# EAGLE design Meldetableau16 (EAGLE 5.04)
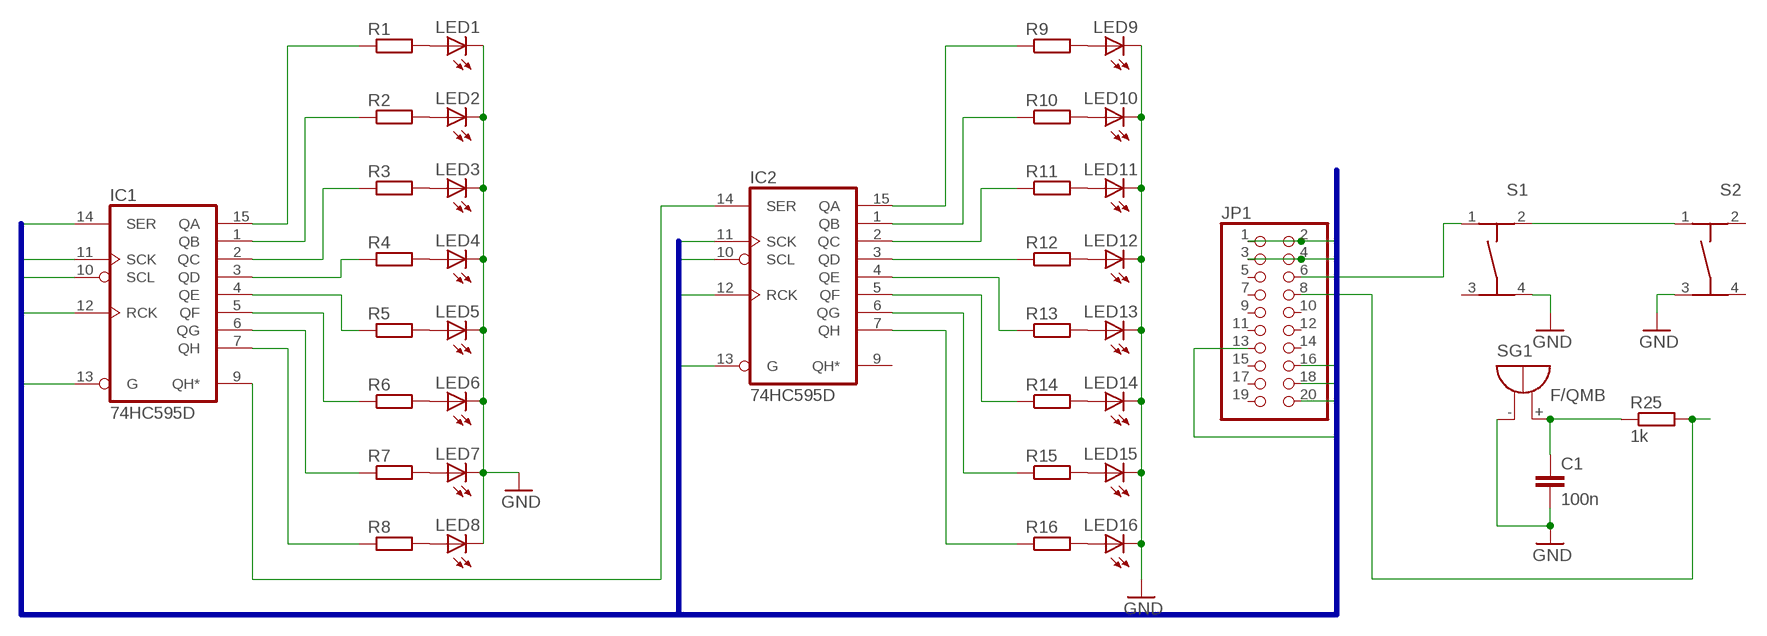
[diagram p0: schematic, sheet 1]

## Parts
C1  100n  C-EUC1206  [C1206]
IC1  74HC595D  [SO16]
IC2  74HC595D  [SO16]
JP1  PINHD-2X10_2.54-SMD  [2X10SMD]
LED1  LEDCHIPLED_1206  [CHIPLED_1206]
LED2  LEDCHIPLED_1206  [CHIPLED_1206]
LED3  LEDCHIPLED_1206  [CHIPLED_1206]
LED4  LEDCHIPLED_1206  [CHIPLED_1206]
LED5  LEDCHIPLED_1206  [CHIPLED_1206]
LED6  LEDCHIPLED_1206  [CHIPLED_1206]
LED7  LEDCHIPLED_1206  [CHIPLED_1206]
LED8  LEDCHIPLED_1206  [CHIPLED_1206]
LED9  LEDCHIPLED_1206  [CHIPLED_1206]
LED10  LEDCHIPLED_1206  [CHIPLED_1206]
LED11  LEDCHIPLED_1206  [CHIPLED_1206]
LED12  LEDCHIPLED_1206  [CHIPLED_1206]
LED13  LEDCHIPLED_1206  [CHIPLED_1206]
LED14  LEDCHIPLED_1206  [CHIPLED_1206]
LED15  LEDCHIPLED_1206  [CHIPLED_1206]
LED16  LEDCHIPLED_1206  [CHIPLED_1206]
R1  R-EU_R1206  [R1206]
R2  R-EU_R1206  [R1206]
R3  R-EU_R1206  [R1206]
R4  R-EU_R1206  [R1206]
R5  R-EU_R1206  [R1206]
R6  R-EU_R1206  [R1206]
R7  R-EU_R1206  [R1206]
R8  R-EU_R1206  [R1206]
R9  R-EU_R1206  [R1206]
R10  R-EU_R1206  [R1206]
R11  R-EU_R1206  [R1206]
R12  R-EU_R1206  [R1206]
R13  R-EU_R1206  [R1206]
R14  R-EU_R1206  [R1206]
R15  R-EU_R1206  [R1206]
R16  R-EU_R1206  [R1206]
R25  1k  R-EU_R1206  [R1206]
S1  TASTER-9314_SMD  [TASTER-9314_SMD]
S2  TASTER-9314_SMD  [TASTER-9314_SMD]
SG1  F/QMB  [F/QMB]

## Nets
G: IC1.13(G) IC2.13(G) JP1.13
GND: C1.2 JP1.1 JP1.2 LED1.C LED2.C LED3.C LED4.C LED5.C LED6.C LED7.C LED8.C LED9.C LED10.C LED11.C LED12.C LED13.C LED14.C LED15.C LED16.C S1.4 S2.3 SG1.-(+)
N$1: LED1.A R1.2
N$2: LED2.A R2.2
N$3: LED3.A R3.2
N$4: LED4.A R4.2
N$5: LED5.A R5.2
N$6: LED6.A R6.2
N$7: LED7.A R7.2
N$8: LED8.A R8.2
N$9: LED9.A R9.2
N$10: LED10.A R10.2
N$11: LED11.A R11.2
N$12: LED12.A R12.2
N$13: LED13.A R13.2
N$14: LED14.A R14.2
N$15: LED15.A R15.2
N$16: LED16.A R16.2
N$17: JP1.8 R25.2
N$18: C1.1 R25.1 SG1.+(-)
N$19: IC1.15(QA) R1.1
N$20: IC1.1(QB) R2.1
N$21: IC1.2(QC) R3.1
N$22: IC1.3(QD) R4.1
N$23: IC1.4(QE) R5.1
N$24: IC1.5(QF) R6.1
N$25: IC1.6(QG) R7.1
N$26: IC1.7(QH) R8.1
N$27: IC1.9(QH*) IC2.14(SER)
N$28: IC2.15(QA) R9.1
N$29: IC2.1(QB) R10.1
N$30: IC2.2(QC) R11.1
N$31: IC2.3(QD) R12.1
N$32: IC2.4(QE) R13.1
N$33: IC2.5(QF) R14.1
N$34: IC2.6(QG) R15.1
N$35: IC2.7(QH) R16.1
N$36: JP1.6 S1.1
N$38: S1.2 S2.1
RCK: IC1.12(RCK) IC2.12(RCK) JP1.16
SCK: IC1.11(SCK) IC2.11(SCK) JP1.18
SER: IC1.14(SER) JP1.20
VCC: IC1.10(SCL) IC2.10(SCL) JP1.3 JP1.4
Unconnected: IC2.9(QH*) JP1.5 JP1.7 JP1.9 JP1.10 JP1.11 JP1.12 JP1.14 JP1.15 JP1.17 JP1.19 S1.3 S2.2 S2.4

## Buses
VCC,GND,SER,SCK,RCK,G

## Power pins joined to a net without a drawn wire
GND: IC1.8(GND) IC2.8(GND)
VCC: IC1.16(VCC) IC2.16(VCC)

## Library data of the parts
C1 = rcl:C-EU: CAPACITOR, European symbol
IC1 IC2 = 74xx-eu:74*595: 8-bit SHIFT REGISTER, output latch
JP1 = pinhead:PINHD-2X10: PIN HEADER
LED1-LED16 = led:LED: LED OSRAM: - CHIPLED LG R971, LG N971, LY N971, LG Q971, LY Q971, LO R971, LY R971 LH N974, LH R974 LS Q976, LO Q976, LY Q976 LO Q996 - Hyper CHIPLED LW Q18S LB Q993, LB Q99A, LB R99A - SideLED LS A670, LO A670, LY A670, LG A670, LP A670 LB A673, LV A673, LT A673, LW A673 LH A674 LY A675 LS A676, LA A676, LO A676, LY A676, LW A676 LS A679, LY A679, LG A679 - Hyper Micro SIDELED® LS Y876, LA Y876, LO Y876, LY Y876 LT Y87S - SmartLED LW L88C, LW L88S LB L89C, LB L89S, LG L890 LS L89K, LO L89K, LY L89K LS L896, LA L896, LO L896, LY L896 - TOPLED LS T670, LO T670, LY T670, LG T670, LP T670 LSG T670, LSP T670, LSY T670, LOP T670, LYG T670 LG T671, LOG T671, LSG T671 LB T673, LV T673, LT T673, LW T673 LH T674 LS T676, LA T676, LO T676, LY T676, LB T676, LH T676, LSB T676, LW T676 LB T67C, LV T67C, LT T67C, LS T67K, LO T67K, LY T67K, LW E67C LS E67B, LA E67B, LO E67B, LY E67B, LB E67C, LV E67C, LT E67C LW T67C LS T679, LY T679, LG T679 LS T770, LO T770, LY T770, LG T770, LP T770 LB T773, LV T773, LT T773, LW T773 LH T774 LS E675, LA E675, LY E675, LS T675 LS T776, LA T776, LO T776, LY T776, LB T776 LHGB T686 LT T68C, LB T68C - Hyper Mini TOPLED® LB M676 - Mini TOPLED Santana® LG M470 LS M47K, LO M47K, LY M47K Source: http://www.osram.convergy.de - LUMILED® LXK2-PW12-R00, LXK2-PW12-S00, LXK2-PW14-U00, LXK2-PW14-V00 LXK2-PM12-R00, LXK2-PM12-S00, LXK2-PM14-U00 LXK2-PE12-Q00, LXK2-PE12-R00, LXK2-PE12-S00, LXK2-PE14-T00, LXK2-PE14-U00 LXK2-PB12-K00, LXK2-PB12-L00, LXK2-PB12-M00, LXK2-PB14-N00, LXK2-PB14-P00, LXK2-PB14-Q00 LXK2-PR12-L00, LXK2-PR12-M00, LXK2-PR14-Q00, LXK2-PR14-R00 LXK2-PD12-Q00, LXK2-PD12-R00, LXK2-PD12-S00 LXK2-PH12-R00, LXK2-PH12-S00 LXK2-PL12-P00, LXK2-PL12-Q00, LXK2-PL12-R00 Source: www.luxeon.com
R1-R16 R25 = rcl:R-EU_: RESISTOR, European symbol
S1 S2 = Ergaenzung:TASTER-9314_SMD
SG1 = buzzer:F/QMB: BUZZER Source: Buerklin

## Board
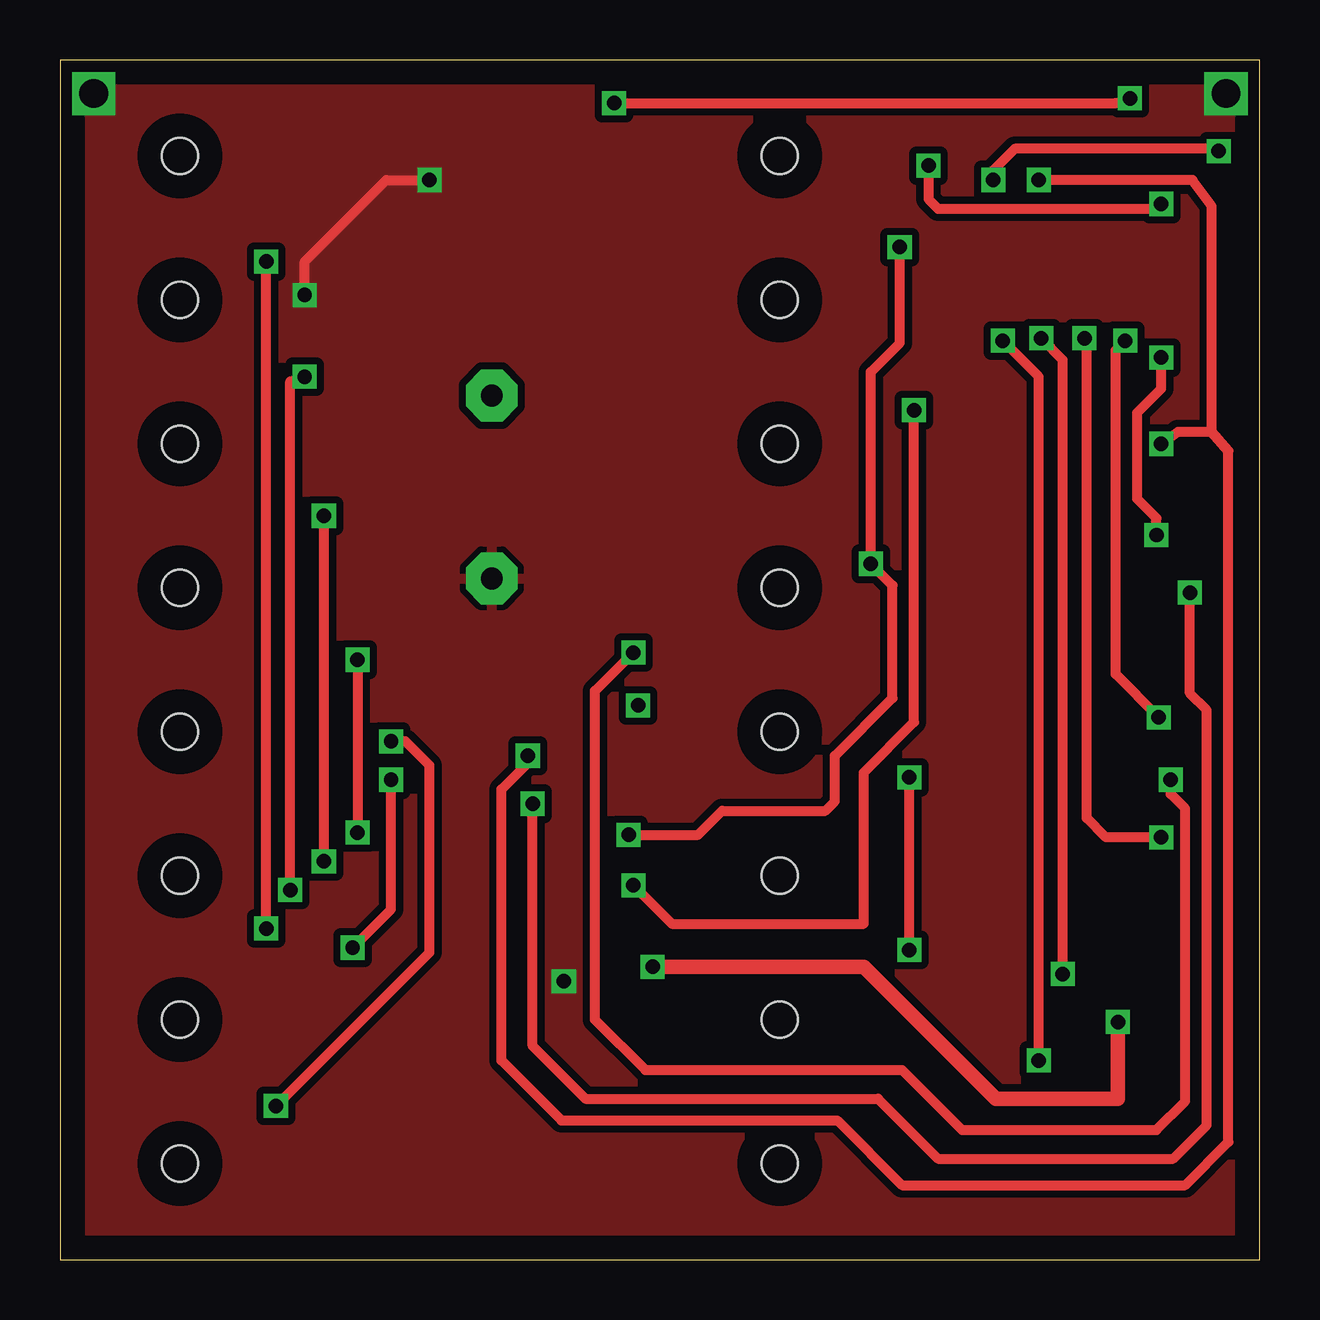
[diagram p1: board, top side]
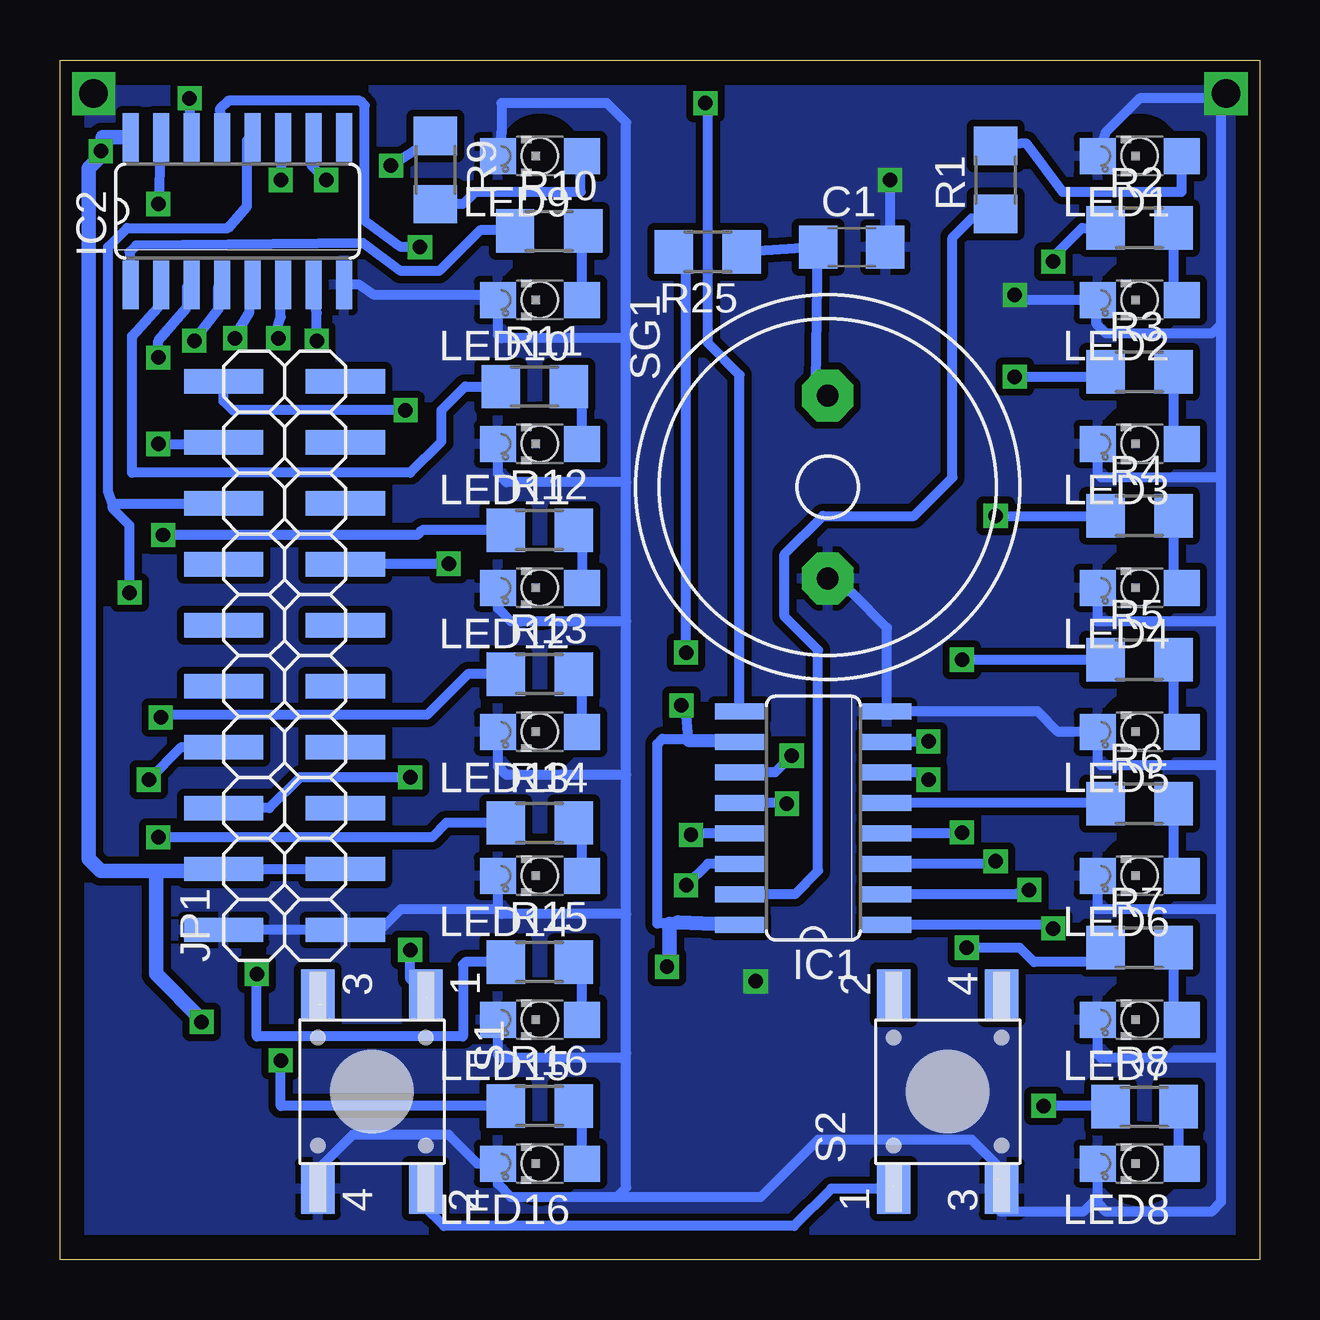
[diagram p2: board, bottom side, seen from below]

Size 50 x 50 mm. Coordinates in mm from the lower left corner, seen from the top.
Outline: 0,0 50,0 50,50 0,50 0,0
Copper layers (1*16): Top 0.035mm / dielectric 1.5mm / Bottom 0.035mm
Design rules "default": minimum track width 10mil, minimum drill 24mil, track to track 8mil, track to pad 8mil, pad to pad 8mil, via to via 8mil, smd to smd 8mil, copper to edge 40mil, drill to drill 8mil, minimum pad ring 10mil, minimum via ring 8mil, stop-mask expansion 4mil, vias tented up to drill 0mil, thermal gap 10mil
Holes 1.5 mm at 5,46 5,40 5,34 5,28 5,22 5,16 5,10 5,4 30,46 30,40 30,34 30,28 30,22 30,16 30,10 30,4

### Footprints (pad centres in the part's own frame; a part is rotated, then mirrored left to right if it is on the bottom)
C1206 = smd 1.6 x 1.8: 1 -1.4,0; 2 1.4,0
SO16 = smd 0.66 x 2.032: 1 -4.445,-3.073; 2 -3.175,-3.073; 3 -1.905,-3.073; 4 -0.635,-3.073; 5 0.635,-3.073; 6 1.905,-3.073; 7 3.175,-3.073; 8 4.445,-3.073; 9 4.445,3.073; 10 3.175,3.073; 11 1.905,3.073; 12 0.635,3.073; 13 -0.635,3.073; 14 -1.905,3.073; 15 -3.175,3.073; 16 -4.445,3.073
2X10SMD = smd 1.016 x 3.302: 1 -1.27,-3.81; 2 -1.27,1.27; 3 1.27,-3.81; 4 1.27,1.27; 5 3.81,-3.81; 6 3.81,1.27; 7 6.35,-3.81; 8 6.35,1.27; 9 8.89,-3.81; 10 8.89,1.27; 11 11.43,-3.81; 12 11.43,1.27; 13 13.97,-3.81; 14 13.97,1.27; 15 16.51,-3.81; 16 16.51,1.27; 17 19.05,-3.81; 18 19.05,1.27; 19 21.59,-3.81; 20 21.59,1.27
CHIPLED_1206 = smd 1.5 x 1.5: A 0,-1.75; C 0,1.75
R1206 = smd 1.6 x 1.803: 1 -1.422,0; 2 1.422,0
TASTER-9314_SMD = smd 2.1 x 1.4: 1 -4.048,2.25; 2 4.048,2.25; 3 -4.048,-2.25; 4 4.048,-2.25
F/QMB = drill 0.914 pad 2.159 octagon: + 3.81,0; - -3.81,0

### Placement (x,y rotation side)
C1  17,42.2 0 bottom
IC1  18.6,18.4 90 bottom
IC2  42.6,43.7 0 bottom
JP1  41.91,15.01 90 bottom
LED1  5,46 90 bottom
LED2  5,40 90 bottom
LED3  5,34 90 bottom
LED4  5,28 90 bottom
LED5  5,22 90 bottom
LED6  5,16 90 bottom
LED7  5,10 90 bottom
LED8  5,4 90 bottom
LED9  30,46 90 bottom
LED10  30,40 90 bottom
LED11  30,34 90 bottom
LED12  30,28 90 bottom
LED13  30,22 90 bottom
LED14  30,16 90 bottom
LED15  30,10 90 bottom
LED16  30,4 90 bottom
R1  11,45 90 bottom
R2  5,43 0 bottom
R3  5,37 0 bottom
R4  5,31 0 bottom
R5  5,25 0 bottom
R6  5,19 0 bottom
R7  5,13 0 bottom
R8  4.79,6.37 0 bottom
R9  34.35,45.41 270 bottom
R10  29.61,42.87 0 bottom
R11  30.21,36.39 0 bottom
R12  30,30.4 0 bottom
R13  30,24.4 0 bottom
R14  30,18.2 0 bottom
R15  30,12.4 0 bottom
R16  30,6.4 0 bottom
R25  23,42 180 bottom
S1  37,7 270 bottom
S2  13,7 90 bottom
SG1  18,32.2 90 bottom

### Tracks (layer width: path | path; a pad name or v marks a point on that pad's centre or on a via)
G  (via drill 0.6)
  Top 0.406: v23.7,17.7 26.6,17.7 27.6,18.7 31.9,18.7 32.3,19.1 32.3,21 34.7,23.4 34.7,28.1 v33.8,29 33.8,37 35,38.2 v35,42.2
  Bottom 0.406: IC1.13 23.64,17.77 v23.7,17.7 | v33.8,29 38.08,29 JP1.13 | IC2.13 43.34,47.97 43,48.3 37.5,48.3 37.3,48.1 37.3,43.3 35.8,42.2 v35,42.2
GND  (via drill 0.6, 1.2)
  Top 0.406: v10.2,40.2 10.2,41.6 13.6,45 v15.4,45
  Bottom 0.406: LED1.C 6.4,47 5,48.4 2,48.4 1.6,48 1.6,39 | 1.6,39 2,38.6 6.4,38.6 6.8,39 6.8,39.75 LED2.C 10,40 v10.2,40.2 | LED3.C 6.75,32.75 6.6,32.6 1.6,32.6 | 6.75,2.6 6.75,2.35 6.4,2 2,2 1.6,2.4 1.6,8.4 | 6.75,2.6 LED8.C | 1.6,8.4 1.6,14.6 | 1.6,14.6 1.6,20.6 | 1.6,20.6 1.6,26.8 | 1.6,26.8 1.6,32.6 | 1.6,32.6 1.6,39 | LED4.C 6.75,26.65 6.8,26.6 1.8,26.6 1.6,26.8 | 1.6,20.6 6.6,20.6 6.75,20.75 LED5.C 8.4,22 9.24,22.84 IC1.8 15.53,26.33 17,27.8 17.61,28 SG1.- | LED6.C 6.75,14.65 6.8,14.6 1.6,14.6 | LED7.C 6.75,8.55 6.6,8.4 1.6,8.4 | 6.75,2.6 7.35,2 10.8,2 10.75,2.05 S2.3 10.8,3 10.8,3.8 12,5 18.4,5 20.8,2.6 26.8,2.6 | S1.4 39.2,3 39.2,3.8 37.8,5.2 33.8,5.2 32.6,4 LED16.C 31.75,3.15 31.2,2.6 26.8,2.6 | LED9.C 31.6,47 31.6,48.2 27.2,48.2 26.4,47.4 26.4,38.4 | 26.4,8.6 26.4,3 26.8,2.6 | 26.4,8.6 26.4,14.4 | 26.4,14.4 26.4,20.2 | 26.4,20.2 26.4,26.6 | 26.4,26.6 26.4,32.4 | 26.4,32.4 26.4,38.4 | LED15.C 31.75,8.55 31.6,8.4 26.6,8.4 26.4,8.6 | 31.75,14.55 LED14.C | 31.75,14.55 31.6,14.4 26.4,14.4 | LED13.C 31.75,20.55 31.4,20.2 26.4,20.2 | LED12.C 31.75,27.15 31.2,26.6 26.4,26.6 | LED11.C 31.75,32.75 31.4,32.4 26.4,32.4 | 26.4,38.4 31.6,38.4 31.75,38.55 LED10.C 31.95,40.2 36.9,40.2 37.53,40.63 IC2.8 | v15.4,45 15.4,42.4 C1.2 | JP1.2 JP1.1 36.66,13.74 35.8,14.6 31.8,14.6 31.75,14.55
  other vias: 1.4,48.6 48.6,48.6 21,11.6
  pour Bottom (isolate 0.305): 0.1,0 0.1,50 50.1,50 50.1,0.1 0.4,0.1
  pour Top (isolate 0.305): 0.1,0.1 0.1,50 50,50 50,-0.1 0.7,-0.1
N$1
  Bottom 0.406: R1.2 9.72,46.52 8.2,44.5 3.25,44.5 LED1.A
N$2
  Bottom 0.406: R2.2 3.58,40.33 LED2.A
N$3
  Bottom 0.406: R3.2 3.58,34.33 LED3.A
N$4
  Bottom 0.406: R4.2 3.58,28.33 LED4.A
N$5
  Bottom 0.406: R5.2 3.58,22.33 LED5.A
N$6
  Bottom 0.406: R6.2 3.58,16.33 LED6.A
N$7
  Bottom 0.406: R7.2 3.58,10.33 LED7.A
N$8
  Bottom 0.406: R8.2 3.37,4.12 LED8.A
N$9
  Bottom 0.406: LED9.A 28.3,46 28.3,44.5 32.7,44.5 33.2,44 34.34,44 R9.2
N$10
  Bottom 0.406: LED10.A 28.25,42.25 28.4,42.4 28.4,42.66 R10.2
N$11
  Bottom 0.406: LED11.A 28.25,36.85 R11.2
N$12
  Bottom 0.406: LED12.A 28.25,30.67 R12.2
N$13
  Bottom 0.406: LED13.A 28.25,24.67 R13.2
N$14
  Bottom 0.406: LED14.A 28.25,18.67 R14.2
N$15
  Bottom 0.406: LED15.A 28.25,12.67 R15.2
N$16
  Bottom 0.406: LED16.A 28.25,6.67 R16.2
N$17  (via drill 0.6)
  Top 0.406: v46.3,20 46.3,19.4 46.9,18.8 46.9,6.6 45.7,5.4 37.6,5.4 35.1,7.9 24.4,7.9 22.3,10 22.3,23.7 v23.9,25.3
  Bottom 0.406: JP1.8 44.94,21.36 v46.3,20 | v23.9,25.3 23.9,41.48 R25.2
N$18
  Bottom 0.406: SG1.+ 18.5,36.51 C1.1 R25.1
N$19
  Bottom 0.406: IC1.15 19.38,15.22 18.4,16.2 18.4,25.4 19.8,26.8 19.8,29.4 18.2,31 14.4,31 12.8,32.6 12.8,42.6 12,43.4 10.58,43.4 R1.1
N$20  (via drill 0.6)
  Top 0.406: v8.6,13.8 v8.6,41.6
  Bottom 0.406: IC1.1 8.96,13.96 v8.6,13.8 | v8.6,41.6 8.6,41.8 7.4,43 R2.1
N$21  (via drill 0.6)
  Top 0.406: v9.6,15.4 9.6,36.6 v10.2,36.8
  Bottom 0.406: IC1.2 10.18,15.22 v9.6,15.4 | v10.2,36.8 6.62,36.8 R3.1
N$22  (via drill 0.6)
  Top 0.406: v11,16.6 v11,31
  Bottom 0.406: IC1.3 11.3,16.5 v11,16.6 | v11,31 R4.1
N$23  (via drill 0.6)
  Top 0.406: v12.4,25 v12.4,17.8
  Bottom 0.406: IC1.4 12.84,17.77 v12.4,17.8 | R5.1 v12.4,25
N$24
  Bottom 0.406: IC1.5 6.46,19.04 R6.1
N$25  (via drill 0.6)
  Top 0.406: v13.8,20 13.8,14.6 v12.2,13
  Bottom 0.406: IC1.6 14.11,20.3 v13.8,20 | v12.2,13 10,13 9.4,12.4 7.02,12.4 R7.1
N$26  (via drill 0.6)
  Top 0.406: v13.8,21.6 14.4,21.6 15.4,20.6 15.4,12.8 v9,6.4
  Bottom 0.406: IC1.7 14.03,21.57 v13.8,21.6 | v9,6.4 6.24,6.4 R8.1
N$27  (via drill 0.6)
  Top 0.406: v23.1,48.2 44,48.2 v44.6,48.4
  Bottom 0.406: IC1.9 21.67,36.87 23,38.2 23,48.1 v23.1,48.2 | 44.6,48 44.6,46.78 IC2.14 | 44.6,48 44.6,48.3 | v44.6,48.4 44.6,48
N$28  (via drill 0.6)
  Top 0.406: v45.9,44 45.4,43.8 36.6,43.8 36.2,44.2 v36.2,45.6
  Bottom 0.406: IC2.15 45.88,44.12 v45.9,44 | v36.2,45.6 34.48,46.7 R9.1
N$29
  Bottom 0.406: IC2.1 47.1,40.67 47.1,42 46.83,42.27 37.37,42.37 35.8,41.2 34.2,41.2 32.5,42.9 31.06,42.9 R10.1
N$30
  Bottom 0.406: R11.1 33.11,36.39 34.1,35.4 34.1,34.1 35.4,32.8 47,32.8 47,38.5 45.9,39.7 45.9,40.6 IC2.2
N$31  (via drill 0.6)
  Top 0.406: v45.7,30.2 45.7,30.9 44.9,31.7 44.9,35.3 45.9,36.3 v45.9,37.6
  Bottom 0.406: R12.1 34.9,30.4 35.1,30.2 v45.7,30.2 | v45.9,37.6 45.9,38.3 44.7,39.7 44.7,40.53 IC2.3
N$32  (via drill 0.6)
  Top 0.406: v45.8,22.6 44,24.4 44,37.9 v44.4,38.3
  Bottom 0.406: R13.1 33,24.4 34.7,22.7 45.7,22.7 v45.8,22.6 | v44.4,38.3 43.4,39.6 43.4,40.56 IC2.4
N$33  (via drill 0.6)
  Top 0.406: v45.9,17.6 43.6,17.6 42.8,18.4 42.8,38.3 v42.7,38.4
  Bottom 0.406: R14.1 33.9,18.2 34.5,17.6 v45.9,17.6 | v42.7,38.4 42.7,38.5 42.1,39.5 42.1,40.59 IC2.5
N$34  (via drill 0.6)
  Top 0.406: v41.8,11.9 41.8,37.5 v40.9,38.4
  Bottom 0.406: R15.1 33.1,12.4 33.2,12.3 33.2,9.3 41.8,9.3 v41.8,11.9 | v40.9,38.4 40.9,39 40.8,39.3 40.8,40.62 IC2.6
N$35  (via drill 0.6)
  Top 0.406: v40.8,8.3 40.8,36.8 v39.3,38.3
  Bottom 0.406: R16.1 40.8,6.4 v40.8,8.3 | v39.3,38.3 39.3,39.45 IC2.7
N$36  (via drill 0.6)
  Top 0.406: v35.4,12.9 v35.4,20.1
  Bottom 0.406: JP1.6 41.28,18.82 40,20.1 v35.4,20.1 | v35.4,12.9 35.4,11.7 S1.1
N$38
  Bottom 0.406: S2.1 17.85,2.95 19.4,1.4 34,1.4 34.8,2.2 34.8,2.9 S1.2
RCK  (via drill 0.6)
  Top 0.406: v19.7,19 19.7,8.9 21.9,6.7 34.1,6.7 36.6,4.2 46.4,4.2 47.8,5.6 47.8,22.9 47.1,23.6 v47.1,27.8
  Bottom 0.406: 47.82,31.52 JP1.16 | 47.82,31.52 48,32 48,42.2 47.2,43 43,43 42.2,43.9 42.2,46.64 IC2.12 | IC1.12 19.73,19.04 v19.7,19 | v47.1,27.8 47.1,30.6 47.8,31.3 47.8,31.5 47.82,31.52
SCK  (via drill 0.6)
  Top 0.406: v19.5,21 19.5,20.7 18.4,19.6 18.4,8.3 20.9,5.8 32.4,5.8 35.1,3.1 46.9,3.1 48.7,4.9 48.7,33.7 48,34.5 | 48,34.5 46.6,34.5 v45.9,34 | v40.8,45 47.2,45 48,43.9 48,34.5
  Bottom 0.406: IC1.11 20.2,20.3 v19.5,21 | v45.9,34 43.24,34 JP1.18 | IC2.11 40.8,44.7 v40.8,45
SER  (via drill 0.6)
  Top 0.406: v35.6,35.4 35.6,22.4 33.5,20.3 33.5,14 25.5,14 v23.9,15.6
  Bottom 0.406: JP1.20 43.18,35.78 42.8,35.4 v35.6,35.4 | v23.9,15.6 23,16.5 IC1.14
VCC  (via drill 0.6)
  Top 0.406: v38.9,45 38.9,45.4 39.8,46.3 48.2,46.3 v48.3,46.2
  Top 0.61: v24.7,12.2 33.5,12.2 39,6.7 44.1,6.7 v44.1,9.9
  Bottom 0.406: JP1.3 JP1.4 43.26,16.2 | 24.25,14.05 24.63,14.03 | 24.63,14.03 25.1,14 25.1,21.5 24.9,21.7 23.8,21.7 | 23.8,21.7 21.8,21.7 IC1.10 23.82,21.57 23.8,21.7 | 23.8,21.7 23.9,22.9 v24.1,23.1 | 24.6,12.3 v24.7,12.2 | v44.1,9.9 44.1,10 | 46,16 45.8,16.2 | 24.63,14.03 24.6,14 | IC2.16 47.2,46.83 | IC2.10 39.52,45.62 v38.9,45 | 48.25,46.05 v48.3,46.2
  Bottom 0.61: IC2.16 48.23,46.77 48.25,46.05 48.8,45.5 48.8,16.7 48.3,16.2 45.8,16.2 43.26,16.2 | IC1.16 24.25,14.05 | 44.1,10 46,11.9 46,16 | 24.6,14 24.6,12.3